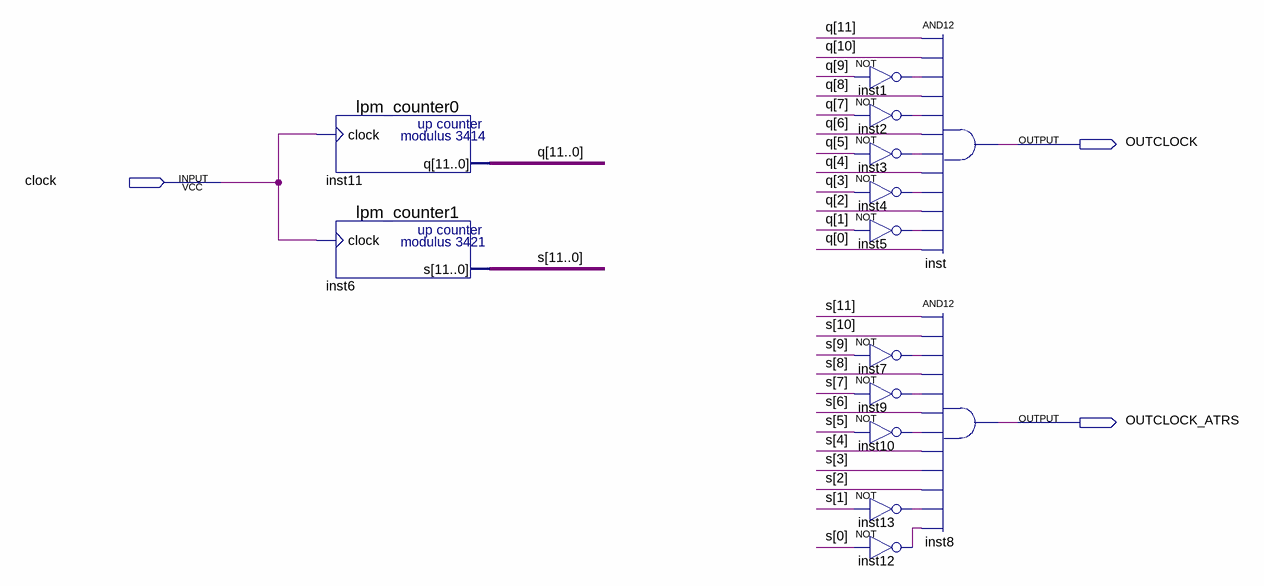
[diagram p0: schematic sheet]
// Quartus schematic gerador_freq.bdf as structural Verilog: 14 symbols, 3 pins
module gerador_freq (
  input  clock,
  output OUTCLOCK,
  output OUTCLOCK_ATRS
);

  wire inst1_out, inst2_out, inst3_out, inst4_out, inst5_out, inst7_out, inst9_out, inst10_out, inst12_out,
       inst13_out;
  wire [11:0] q, s;

  lpm_counter0 inst11 (.clock(clock), .q(q));
  lpm_counter1 inst6 (.clock(clock), .s(s));
  not inst1 (inst1_out, q[9]);
  not inst2 (inst2_out, q[7]);
  not inst3 (inst3_out, q[5]);
  not inst4 (inst4_out, q[3]);
  not inst5 (inst5_out, q[1]);
  not inst7 (inst7_out, s[9]);
  not inst9 (inst9_out, s[7]);
  not inst10 (inst10_out, s[5]);
  not inst13 (inst13_out, s[1]);
  not inst12 (inst12_out, s[0]);
  and inst (OUTCLOCK, q[11], q[10], inst1_out, q[8], inst2_out, q[6], inst3_out, q[4], inst4_out, q[2], inst5_out, q[0]);
  and inst8 (OUTCLOCK_ATRS, s[11], s[10], inst7_out, s[8], inst9_out, s[6], inst10_out, s[4], s[3], s[2], inst13_out, inst12_out);
endmodule
